# Altium schematic sheet Power.SchDoc
size A3; SheetNumber: 1; SheetTotal: 2
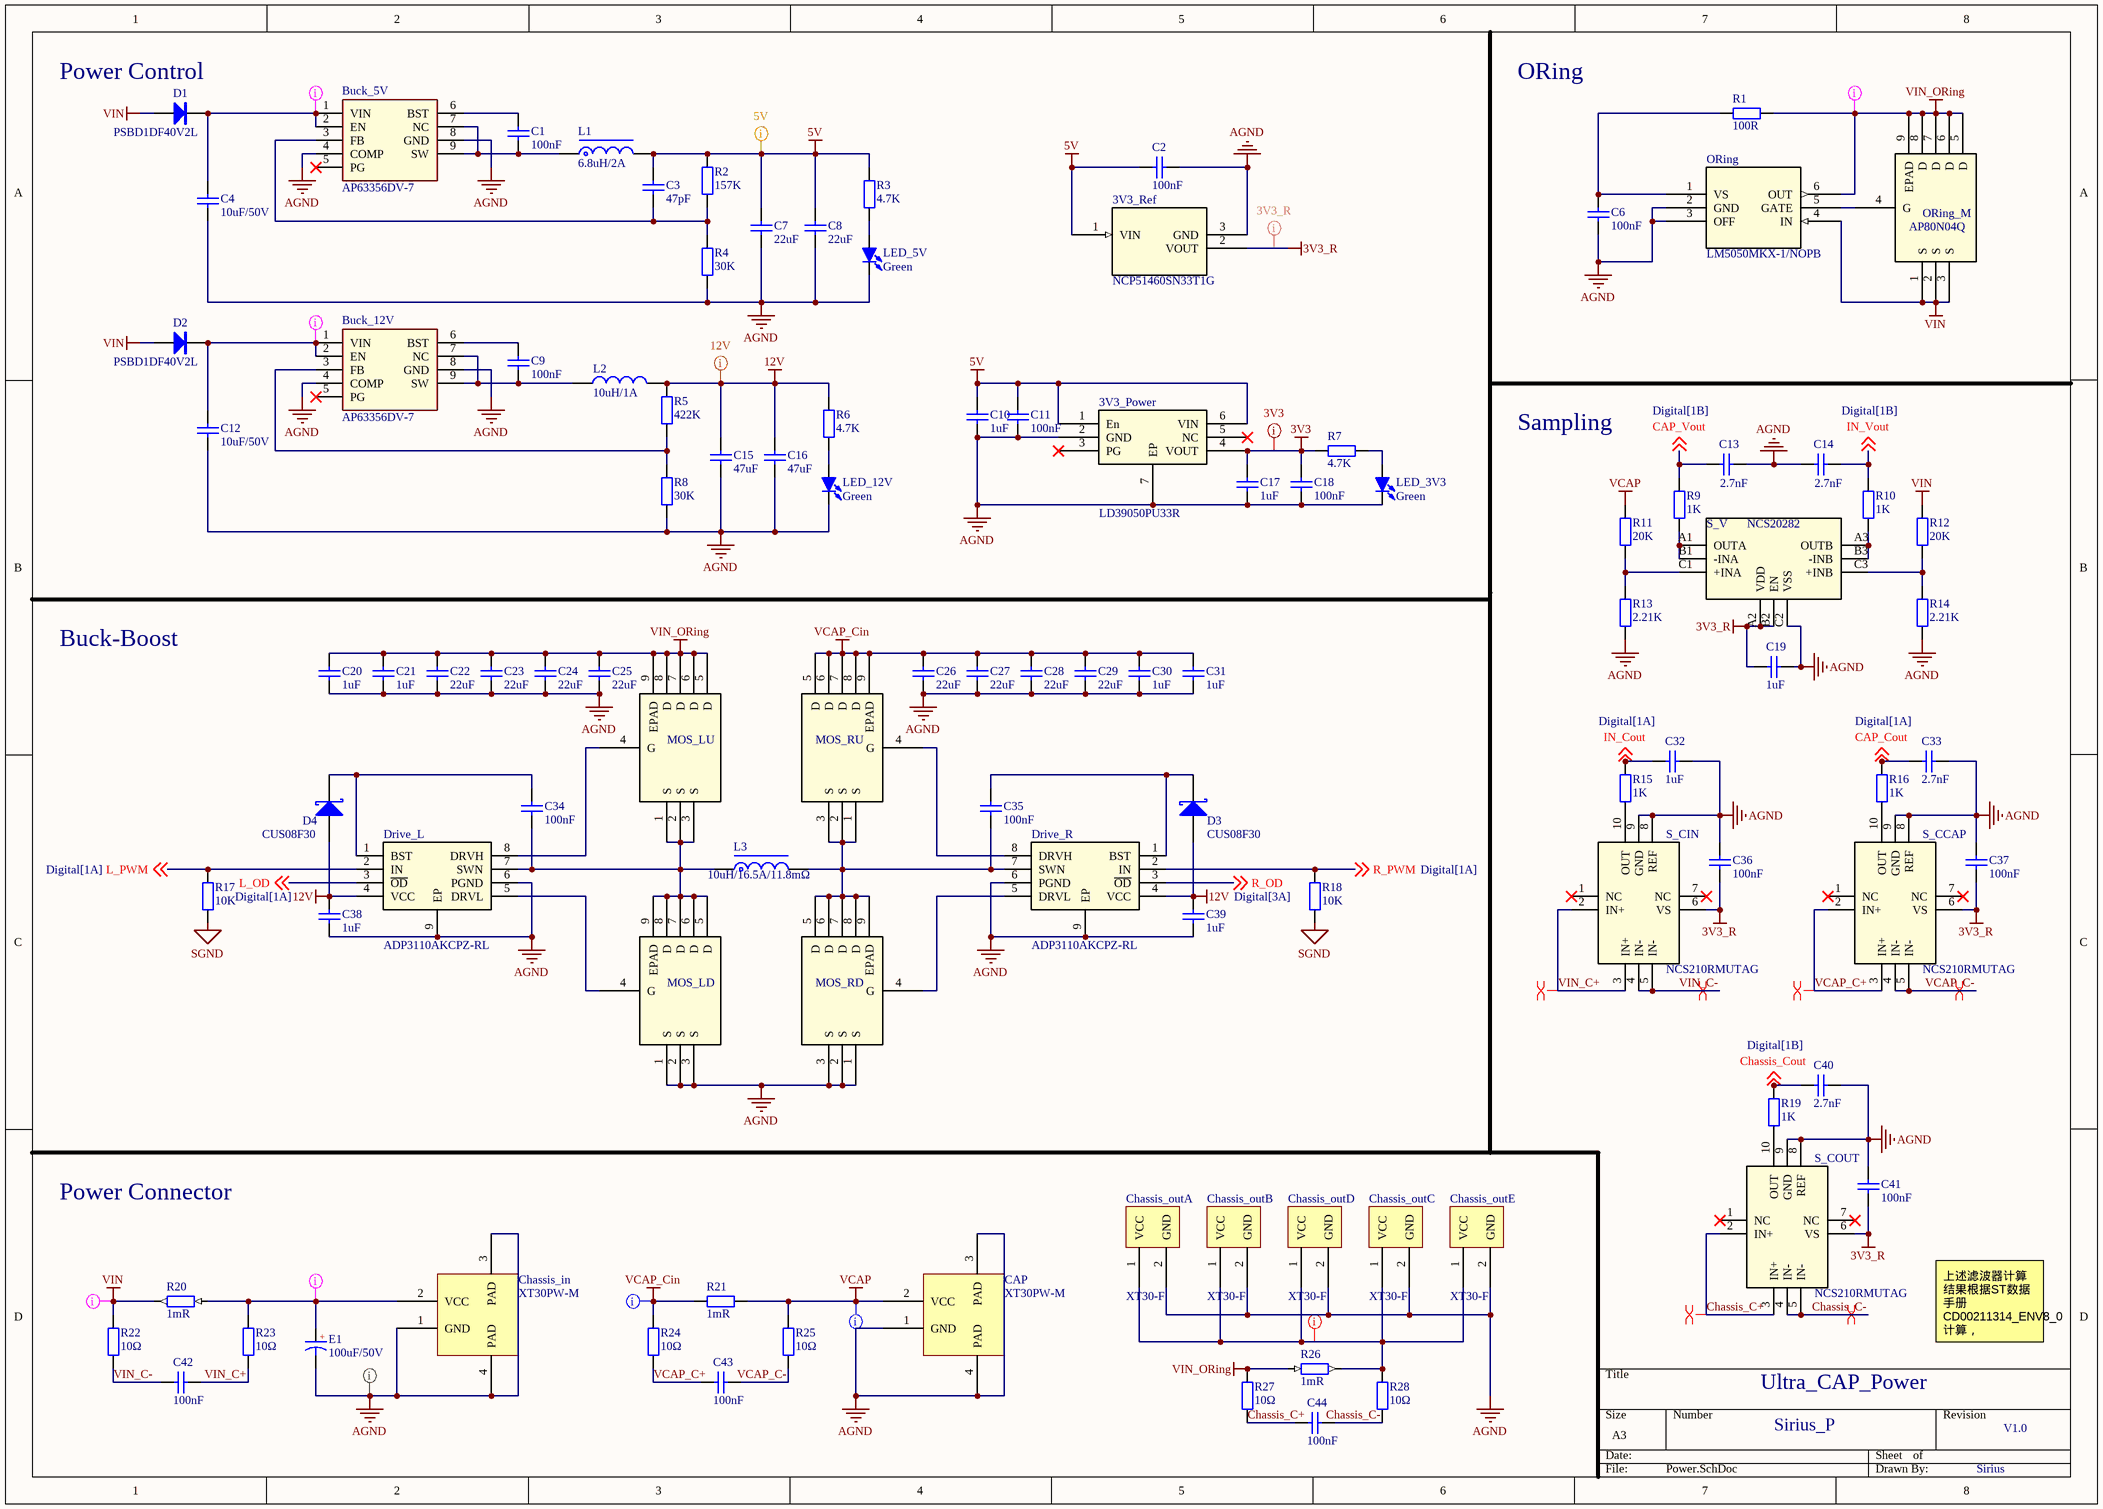
[diagram p0: Power.SchDoc]

## Parts
3V3_Power  LD39050PU33R  [SON_DFN6_3X3_STM-L]
3V3_Ref  NCP51460SN33T1G  [SOT23]
Buck_5V  AP63356DV-7  [AP63356DV7]
Buck_12V  AP63356DV-7  [AP63356DV7]
C1  100nF  [C0603_L]
C2  100nF  [C0603_L]
C3  47pF  [C0603_L]
C4  10uF/50V  [C0603_L]
C6  100nF  [C0603_L]
C7  22uF  [C1210_L]
C8  22uF  [C1210_L]
C9  100nF  [C0603_L]
C10  1uF  [C0603_L]
C11  100nF  [C0603_L]
C12  10uF/50V  [C0603_L]
C13  2.7nF  [C0603_L]
C14  2.7nF  [C0603_L]
C15  47uF  [C1206_L]
C16  47uF  [C1206_L]
C17  1uF  [C0603_L]
C18  100nF  [C0603_L]
C19  1uF  [C0603_L]
C20  1uF  [C0603_L]
C21  1uF  [C0603_L]
C22  22uF  [C2220_no overlay]
C23  22uF  [C2220_no overlay]
C24  22uF  [C2220_no overlay]
C25  22uF  [C2220_no overlay]
C26  22uF  [C2220_no overlay]
C27  22uF  [C2220_no overlay]
C28  22uF  [C2220_no overlay]
C29  22uF  [C2220_no overlay]
C30  1uF  [C0603_L]
C31  1uF  [C0603_L]
C32  1uF  [C0603_L]
C33  2.7nF  [C0603_L]
C34  100nF  [C0603_L]
C35  100nF  [C0603_L]
C36  100nF  [C0603_L]
C37  100nF  [C0603_L]
C38  1uF  [C0603_L]
C39  1uF  [C0603_L]
C40  2.7nF  [C0603_L]
C41  100nF  [C0603_L]
C42  100nF  [C0603_L]
C43  100nF  [C0603_L]
C44  100nF  [C0603_L]
CAP  XT30PW-M  [CONN-TH_XT30PW-M]
Chassis_in  XT30PW-M  [CONN-TH_XT30PW-M]
Chassis_outA  XT30-F  [XT30-F]
Chassis_outB  XT30-F  [XT30-F]
Chassis_outC  XT30-F  [XT30-F]
Chassis_outD  XT30-F  [XT30-F]
Chassis_outE  XT30-F  [XT30-F]
D1  PSBD1DF40V2L  [SOD-123]
D2  PSBD1DF40V2L  [SOD-123]
D3  CUS08F30  [SOD-323]
D4  CUS08F30  [SOD-323]
Drive_L  ADP3110AKCPZ-RL  [SON50P300X300X100-9N]
Drive_R  ADP3110AKCPZ-RL  [SON50P300X300X100-9N]
E1  100uF/50V  [CT 3.5*8*8 - R]
L1  6.8uH/2A  [L-SMD-0420]
L2  10uH/1A  [L1210]
L3  10uH/16.5A/11.8mΩ  [INDPM176169X700N]
LED_3V3  Green  [LED0603_G]
LED_5V  Green  [LED0603_G]
LED_12V  Green  [LED0603_G]
MOS_LD  HYG025N06LS1C2  [PDFN5*6-8l]  (value not drawn)
MOS_LU  HYG025N06LS1C2  [PDFN5*6-8l]  (value not drawn)
MOS_RD  HYG025N06LS1C2  [PDFN5*6-8l]  (value not drawn)
MOS_RU  HYG025N06LS1C2  [PDFN5*6-8l]  (value not drawn)
ORing  LM5050MKX-1/NOPB  [SOT23-6]
ORing_M  AP80N04Q  [TDFN33-8]
R1  100R  [R0603_L]
R2  157K  [R0603_L]
R3  4.7K  [R0603_L]
R4  30K  [R0603_L]
R5  422K  [R0603_L]
R6  4.7K  [R0603_L]
R7  4.7K  [R0603_L]
R8  30K  [R0603_L]
R9  1K  [R0603_L]
R10  1K  [R0603_L]
R11  20K  [R0603_L]
R12  20K  [R0603_L]
R13  2.21K  [R0603_L]
R14  2.21K  [R0603_L]
R15  1K  [R0603_L]
R16  1K  [R0603_L]
R17  10K  [R0603_L]
R18  10K  [R0603_L]
R19  1K  [R0603_L]
R20  1mR  [R2512_L]
R21  1mR  [R2512_L]
R22  10Ω  [R0603_L]
R23  10Ω  [R0603_L]
R24  10Ω  [R0603_L]
R25  10Ω  [R0603_L]
R26  1mR  [R2512_L]
R27  10Ω  [R0603_L]
R28  10Ω  [R0603_L]
S_CCAP  NCS210RMUTAG  [QFN40P140X180X60-10N]
S_CIN  NCS210RMUTAG  [QFN40P140X180X60-10N]
S_COUT  NCS210RMUTAG  [QFN40P140X180X60-10N]
S_V  NCS20282  [BGA9C40P3X3_122X122X62]

## Nets
3V3: 3V3_Power.4(VOUT) C17.2 C18.2 R7.2
3V3_R: 3V3_Ref.2(VOUT) C19.2 C36.1 C37.1 C41.1 S_CCAP.6(VS) S_CIN.6(VS) S_COUT.6(VS) S_V.A2(VDD) S_V.B2(EN)
5V: 3V3_Power.1(En) 3V3_Power.6(VIN) 3V3_Ref.1(VIN) C2.2 C3.2 C7.2 C8.2 C10.2 C11.2 L1.2 R2.2 R3.2
12V: C15.2 C16.2 C38.1 C39.1 D3.1(A) D4.1(A) Drive_L.4(VCC) Drive_R.4(VCC) L2.2 R5.2 R6.2
AGND: 3V3_Power.2(GND) 3V3_Power.7(EP) 3V3_Ref.3(GND) Buck_5V.4(COMP) Buck_5V.8(GND) Buck_12V.4(COMP) Buck_12V.8(GND) C2.1 C4.1 C6.1 C7.1 C8.1 C10.1 C11.1 C12.1 C13.2 C14.1 C15.1 C16.1 C17.1 C18.1 C19.1 C20.1 C21.1 C22.1 C23.1 C24.1 C25.1 C26.1 C27.1 C28.1 C29.1 C30.1 C31.1 C32.2 C33.2 C36.2 C37.2 C38.2 C39.2 C40.2 C41.2 CAP.1(GND) CAP.3(PAD) CAP.4(PAD) Chassis_in.1(GND) Chassis_in.3(PAD) Chassis_in.4(PAD) Chassis_outA.2(GND) Chassis_outB.2(GND) Chassis_outC.2(GND) Chassis_outD.2(GND) Chassis_outE.2(GND) Drive_L.6(PGND) Drive_L.9(EP) Drive_R.6(PGND) Drive_R.9(EP) E1.2 LED_3V3.2(K) LED_5V.2(K) LED_12V.2(K) MOS_LD.1(S) MOS_LD.2(S) MOS_LD.3(S) MOS_RD.1(S) MOS_RD.2(S) MOS_RD.3(S) ORing.2(GND) ORing.3(OFF) R4.1 R8.1 R13.1 R14.1 S_CCAP.8(REF) S_CCAP.9(GND) S_CIN.8(REF) S_CIN.9(GND) S_COUT.8(REF) S_COUT.9(GND) S_V.C2(VSS)
SGND: R17.2 R18.2
VCAP: CAP.2(VCC) R11.1 R21.2 R25.2
VCAP_Cin: C26.2 C27.2 C28.2 C29.2 C30.2 C31.2 MOS_RU.5(D) MOS_RU.6(D) MOS_RU.7(D) MOS_RU.8(D) MOS_RU.9(EPAD) R21.1 R24.2
VIN: D1.1(A) D2.1(A) ORing.4(IN) ORing_M.1(S) ORing_M.2(S) ORing_M.3(S) R12.1 R20.1 R22.2
VIN_ORing: C20.2 C21.2 C22.2 C23.2 C24.2 C25.2 MOS_LU.5(D) MOS_LU.6(D) MOS_LU.7(D) MOS_LU.8(D) MOS_LU.9(EPAD) ORing.6(OUT) ORing_M.5(D) ORing_M.6(D) ORing_M.7(D) ORing_M.8(D) ORing_M.9(EPAD) R1.2 R26.1 R27.1
CAP_Cout: C33.1 R16.1 ; off-sheet CAP_Cout
CAP_Vout: C13.1 R9.1 ; off-sheet CAP_Vout
Chassis_C+: C44.2 R27.2 S_COUT.2(IN+) S_COUT.3(IN+)
Chassis_C-: C44.1 R28.1 S_COUT.4(IN-) S_COUT.5(IN-)
Chassis_Cout: C40.1 R19.1 ; off-sheet Chassis_Cout
IN_Cout: C32.1 R15.1 ; off-sheet IN_Cout
IN_Vout: C14.2 R10.1 ; off-sheet IN_Vout
L_OD: Drive_L.3(~{OD}) ; off-sheet L_OD
L_PWM: Drive_L.2(IN) R17.1 ; off-sheet L_PWM
R_OD: Drive_R.3(~{OD}) ; off-sheet R_OD
R_PWM: Drive_R.2(IN) R18.1 ; off-sheet R_PWM
VCAP_C+: C43.2 R24.1 S_CCAP.2(IN+) S_CCAP.3(IN+)
VCAP_C-: C43.1 R25.1 S_CCAP.4(IN-) S_CCAP.5(IN-)
VIN_C+: C42.1 R23.1 S_CIN.2(IN+) S_CIN.3(IN+)
VIN_C-: C42.2 R22.1 S_CIN.4(IN-) S_CIN.5(IN-)
NetBuck_5V_1: Buck_5V.1(VIN) Buck_5V.2(EN) C4.2 D1.2(K)
NetBuck_5V_3: Buck_5V.3(FB) C3.1 R2.1 R4.2
NetBuck_5V_6: Buck_5V.6(BST) C1.2
NetBuck_5V_7: Buck_5V.7(NC) Buck_5V.9(SW) C1.1 L1.1
NetBuck_12V_1: Buck_12V.1(VIN) Buck_12V.2(EN) C12.2 D2.2(K)
NetBuck_12V_3: Buck_12V.3(FB) R5.1 R8.2
NetBuck_12V_6: Buck_12V.6(BST) C9.2
NetBuck_12V_7: Buck_12V.7(NC) Buck_12V.9(SW) C9.1 L2.1
NetC6_2: C6.2 ORing.1(VS) R1.1
NetC34_1: C34.1 D4.2(K) Drive_L.1(BST)
NetC34_2: C34.2 Drive_L.7(SWN) L3.1 MOS_LD.5(D) MOS_LD.6(D) MOS_LD.7(D) MOS_LD.8(D) MOS_LD.9(EPAD) MOS_LU.1(S) MOS_LU.2(S) MOS_LU.3(S)
NetC35_1: C35.1 D3.2(K) Drive_R.1(BST)
NetC35_2: C35.2 Drive_R.7(SWN) L3.2 MOS_RD.5(D) MOS_RD.6(D) MOS_RD.7(D) MOS_RD.8(D) MOS_RD.9(EPAD) MOS_RU.1(S) MOS_RU.2(S) MOS_RU.3(S)
NetChassis_in_2: Chassis_in.2(VCC) E1.1 R20.2 R23.2
NetChassis_outA_1: Chassis_outA.1(VCC) Chassis_outB.1(VCC) Chassis_outC.1(VCC) Chassis_outD.1(VCC) Chassis_outE.1(VCC) R26.2 R28.2
NetDrive_L_5: Drive_L.5(DRVL) MOS_LD.4(G)
NetDrive_L_8: Drive_L.8(DRVH) MOS_LU.4(G)
NetDrive_R_5: Drive_R.5(DRVL) MOS_RD.4(G)
NetDrive_R_8: Drive_R.8(DRVH) MOS_RU.4(G)
NetLED_3V3_1: LED_3V3.1(A) R7.1
NetLED_5V_1: LED_5V.1(A) R3.1
NetLED_12V_1: LED_12V.1(A) R6.1
NetORing_5: ORing.5(GATE) ORing_M.4(G)
NetR9_2: R9.2 S_V.A1(OUTA) S_V.B1(-INA)
NetR10_2: R10.2 S_V.A3(OUTB) S_V.B3(-INB)
NetR11_2: R11.2 R13.2 S_V.C1(+INA)
NetR12_2: R12.2 R14.2 S_V.C3(+INB)
NetR15_2: R15.2 S_CIN.10(OUT)
NetR16_2: R16.2 S_CCAP.10(OUT)
NetR19_2: R19.2 S_COUT.10(OUT)

Not connected (* = marked no-connect by the designer): 3V3_Power 3(PG)* 5(NC)*; Buck_5V 5(PG)*; Buck_12V 5(PG)*; S_CCAP 1(NC)* 7(NC)*; S_CIN 1(NC)* 7(NC)*; S_COUT 1(NC)* 7(NC)*

## Layout directives
rule Supply Nets [Voltage = 5.000]; net class Power_Class: 5V
rule Supply Nets [Voltage = 3.300]; net class Power_Class: 3V3, 3V3_R
rule Supply Nets [Voltage = 0.000]; net class Power_Class: AGND
rule Supply Nets [Voltage = 24.00]; net class Power_Class: NetBuck_5V_1, NetBuck_12V_1, NetChassis_in_2, VIN, VIN_ORing
rule Supply Nets [Voltage = 23.50]; net class Power_Class: VCAP, VCAP_Cin
rule Supply Nets [Voltage = 12.00]; net class Power_Class: 12V
differential pair: Chassis_C+, Chassis_C-, VCAP_C+, VCAP_C-, VIN_C+, VIN_C-
net class Power_Class: NetChassis_outA_1

## Notes on the sheet
- (near D1) Power Control
- ORing
- Sampling
- Buck-Boost
- Power Connector
- Ultra_CAP_Power
- 上述滤波器计算结果根据ST数据手册CD00211314_ENV8_0计算，FAINmax=37kHz
- Sirius_P
- V1.0
- Sirius
- (in symbol CS) +

## Library data of the parts
3V3_Power = LD39050PU33R: LDO-3V3/500mA
3V3_Ref = NCP51460SN33T1G: 基准电压源3V3; Mfr_Name: onsemi; Copyright: Copyright (C) 2022 Ultra Librarian. All rights reserved.; Manufacturer_Part_Number: NCP51460SN33T1G; RefDes: RefDes; Type: DEV
Buck_5V Buck_12V = AP63356DV-7: Switching Voltage Regulators DCDC Conv HV Buck V-DFN3020-13 T&R 3K 3.8V TO 32V INPUT, 3.5A LOW IQ SYNCHRONOUS BUCK WITH ENHANCED EMI REDUCTION; Manufacturer_Name: Diodes Inc.; Geometry.Height: 0.85mm; Mouser Part Number: 621-AP63356DV-7; Mouser Price/Stock: https://www.mouser.co.uk/ProductDetail/Diodes-Incorporated/AP63356DV-7?qs=bZr6mbWTK5k9UirUfdvjSw%3D%3D; Manufacturer_Part_Number: AP63356DV-7; Datasheet Link: https://www.diodes.com/assets/Datasheets/AP63356-AP63357.pdf
C1-C4 C6-C44 = C: 贴片电容; BOM名称: 无极性贴片电容; 联系卖家，免费查找封装: 唯一出售店铺网址https://shop463601444.taobao.com
D1 D2 = 1N5822: 肖特基二极管; 联系卖家，免费查找封装: 唯一出售店铺网址https://shop463601444.taobao.com; BOM名称: 肖特基二极管
D3 D4 = 1N5819: 肖特基二极管; 联系卖家，免费查找封装: 唯一出售店铺网址https://shop463601444.taobao.com; BOM名称: 肖特基二极管
Drive_L Drive_R = ADP3110AKCPZ-RL: ON SEMICONDUCTOR - ADP3110AKCPZ-RL - MOSFET Driver, High Side And Low Side, 4.6V-13.2V Supply, 1A Out, 20ns Delay, DFN-8; Manufacturer_Name: onsemi; Geometry.Height: 1mm; Manufacturer_Part_Number: ADP3110AKCPZ-RL; Mouser Part Number: 863-ADP3110AKCPZ-RL; Mouser Price/Stock: https://www.mouser.co.uk/ProductDetail/ON-Semiconductor/ADP3110AKCPZ-RL?qs=t2BMfLoP1KSx%2FvThl35SBw%3D%3D; Arrow Part Number: ADP3110AKCPZ-RL; Arrow Price/Stock: https://www.arrow.com/en/products/adp3110akcpz-rl/on-semiconductor; Mouser Testing Part Number: *; Mouser Testing Price/Stock: *; Datasheet Link: http://www.onsemi.com/pub/Collateral/ADP3110A-D.PDF
E1 = CS: 直插固态电容; 联系卖家，免费查找封装: 唯一出售店铺网址https://shop463601444.taobao.com; BOM名称: 直插固态电容
L1 = L-Molding Choke: 一体成型电感; 联系卖家，免费查找封装: 唯一出售店铺网址https://shop463601444.taobao.com; BOM名称: 一体成型电感
L2 = L: 贴片小功率电感; BOM名称: 小功率贴片电感; 联系卖家，免费查找封装: 唯一出售店铺网址https://shop463601444.taobao.com
L3 = L-Molding Choke: 一体成型电感 / TMPC1707HP-100MG-D; 联系卖家，免费查找封装: 唯一出售店铺网址https://shop463601444.taobao.com; BOM名称: 一体成型电感
LED_3V3 LED_5V LED_12V = LED-SMD: 贴片LED; 联系卖家 免费查找封装: 封装库来自淘宝卖家ID：黄晶宝石; BOM名称: 贴片LED
MOS_LD MOS_LU MOS_RD MOS_RU = HYG025N06LS1C2: NMOS 60V/170A; Mfr_Name: Alpha and Omega Semiconductor; Manufacturer_Part_Number: AON7418; Copyright: Copyright (C) 2022 Ultra Librarian. All rights reserved.; RefDes: RefDes; Type: DEV
ORing = LM5050MKX-1/NOPB: 理想二极管控制器; Mfr_Name: Texas Instruments; Copyright: Copyright (C) 2022 Ultra Librarian. All rights reserved.; Manufacturer_Part_Number: LM5050MKX-1/NOPB; RefDes: RefDes; Type: DEV
ORing_M = AP80N04Q: Trans MOSFET N-CH 40V 40A 8-Pin PDFN EP T/R; Manufacturer_Name: Taiwan Semiconductor; Manufacturer_Part_Number: TSM085P03CV RGG; Geometry.Height: 0.75mm; Mouser Part Number: 821-TSM085P03CVRGG; Mouser Price/Stock: https://www.mouser.co.uk/ProductDetail/Taiwan-Semiconductor/TSM085P03CV-RGG?qs=4pzlT8jjbhd4XXSAn%252BJ6qw%3D%3D; Arrow Part Number: TSM085P03CV RGG; Arrow Price/Stock: https://www.arrow.com/en/products/tsm085p03cvrgg/taiwan-semiconductor; Mouser Testing Part Number: *; Mouser Testing Price/Stock: *; Datasheet Link: https://componentsearchengine.com/Datasheets/1/TSM085P03CV RGG.pdf
R1-R28 = R: 贴片电阻; 联系卖家，免费查找封装: 唯一出售店铺网址https://shop463601444.taobao.com; BOM名称: 贴片电阻
S_CCAP S_CIN S_COUT = NCS210RMUTAG: CURRENT SENSE AMP G=200; Manufacturer_Name: onsemi; Geometry.Height: 0.6mm; Manufacturer_Part_Number: NCS210RMUTAG; Mouser Part Number: 863-NCS210RMUTAG; Mouser Price/Stock: https://www.mouser.co.uk/ProductDetail/ON-Semiconductor/NCS210RMUTAG?qs=lYGu3FyN48dPWsNmv2BxUw%3D%3D; Arrow Part Number: NCS210RMUTAG; Arrow Price/Stock: https://www.arrow.com/en/products/ncs210rmutag/on-semiconductor?region=nac; Mouser Testing Part Number: *; Mouser Testing Price/Stock: *; Datasheet Link: http://www.onsemi.com/pub/Collateral/NCS210R-D.PDF
S_V = NCS20282: 7 MHz, 125 A Low Power Operational Amplifier; Manufacturer_Name: onsemi; Manufacturer_Part_Number: FAN48610UC50X; Geometry.Height: 0.619mm; Mouser Part Number: 512-FAN48610UC50X; Mouser Price/Stock: https://www.mouser.co.uk/ProductDetail/ON-Semiconductor-Fairchild/FAN48610UC50X?qs=3SGS%2FGl3GGz6Cj18V%2F7jcA%3D%3D; Arrow Part Number: FAN48610UC50X; Arrow Price/Stock: https://www.arrow.com/en/products/fan48610uc50x/on-semiconductor?region=nac; Mouser Testing Part Number: *; Mouser Testing Price/Stock: *; Datasheet Link: https://www.onsemi.com/pub/Collateral/FAN48610-D.pdf